# Altium schematic sheet MAIN POWER.SchDoc
size A4; DocumentNumber: 2; SheetNumber: 2; SheetTotal: 34
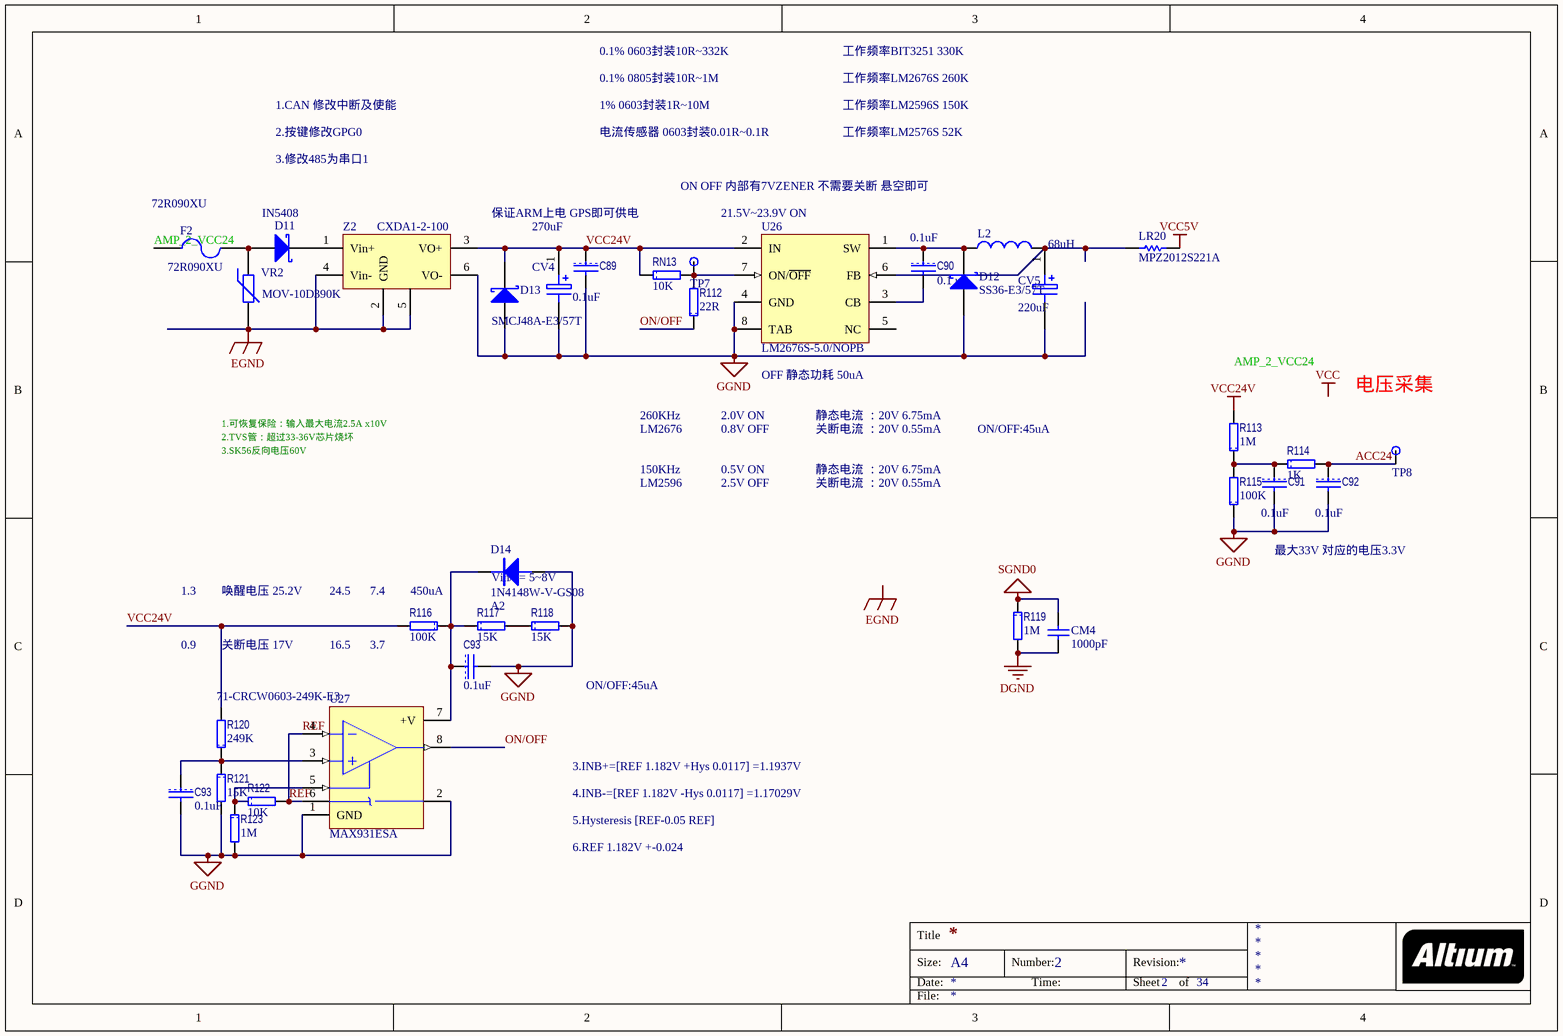
[diagram p0: MAIN POWER.SchDoc]

## Parts
(Parts that share a designator on the sheet are numbered #1, #2 ... from top to bottom, then left to right.)
C89  value 0.1uF  [1608[0603]C]  (hidden comment: C1608X7R1H104K)
C90  value 0.1uF  电容: 0.1 uF  [1608[0603]C]  (hidden comment: C1608X7R1H104K)
C91  value 0.1uF  [1608[0603]C]  (hidden comment: C1608X7R1H104K)
C92  value 0.1uF  [1608[0603]C]  (hidden comment: C1608X7R1H104K)
C93#1  value 0.1uF  [1608[0603]C]  (hidden comment: C1608X7R1H104K)
C93#2  value 0.1uF  [1608[0603]C]  (hidden comment: C1608X7R1H104K)
CM4  value 1000pF  [4532[1812]CA]  (hidden comment: 1812HC102MAZ1A)
CV4  value 270uF  [CAPPR5-10x20/H1.1]  (hidden comment: EEU-FM1H271)
CV5  value 220uF  [CAPPR5-10x20/H1.1]  (hidden comment: EEU-FM1V221)
D11  IN5408  [DO-214AB/SMC]
D12  SS36-E3/57T  [DO-214AB/SMC]
D13  SMCJ48A-E3/57T  [DO-214AB/SMC]
D14  1N4148W-V-GS08  value A2  [SOD123]
F2  72R090XU  [FUS-0.2]
L2  value 68uH  [INDP125125X85N]  (hidden comment: B82477P4683M000)
LR20  MPZ2012S221A  [2012[0805]]
R112  value 22R  [1608[0603]R]  (hidden comment: CRCW060322R0FKEA)
R113  value 1M  [1608[0603]R]  (hidden comment: CRCW06031M00FKEA)
R114  value 1K  [1608[0603]R]  (hidden comment: CRCW06031K00FKEA)
R115  value 100K  [1608[0603]R]  (hidden comment: CRCW0603100KFKEA)
R116  value 100K  [1608[0603]R]  (hidden comment: CRCW0603100KFKEA)
R117  value 15K  [1608[0603]R]  (hidden comment: CRCW060315K0FKEA)
R118  value 15K  [1608[0603]R]  (hidden comment: CRCW060315K0FKEA)
R119  value 1M  [1608[0603]R]  (hidden comment: CRCW06031M00FKEA)
R120  value 249K  Supplier Part Number 1: 71-CRCW0603-249K-E3  [1608[0603]R]  (hidden comment: CRCW0603249KFKEA)
R121  value 15K  [1608[0603]R]  (hidden comment: CRCW060315K0FKEA)
R122  value 10K  [1608[0603]R]  (hidden comment: CRCW060310K0FKEA)
R123  value 1M  [1608[0603]R]  (hidden comment: CRCW060310K0FKEA)
RN13  value 10K  [1608[0603]RN]  (hidden comment: CRCW060310K0FKEA)
TP7  TP  [TP]  (value not drawn)
TP8  TP  [TP]  (value not drawn)
U26  LM2676S-5.0/NOPB  [TS7B_N]
U27  MAX931ESA  [NSO8_N]
VR2  MOV-10D390K  [RAD-0.3]
Z2  CXDA1-2-100  [CXDA1-2-100]

## Nets
DGND: CM4.1 R119.2
EGND: VR2.2 Z2.2(GND) Z2.4(Vin-) Z2.5(GND)
GGND: C89.2 C91.2 C92.2 C93#1.2 C93#2.2 CV4.2 CV5.2 D12.1(A) D13.1(A) D14.1(A) R115.1 R118.2 R121.2 R123.2 U26.4(GND) U26.8(TAB) U27.1(GND) U27.2(-V) Z2.6(VO-)
SGND0: CM4.2 R119.1
VCC5V: LR20.2
VCC24V: C89.1 CV4.1 D13.2(K) R113.2 R116.2 R120.2 RN13.1 U26.2(IN) Z2.3(VO+)
ACC24: C92.1 R114.2 TP8.1(TestPoint)
AMP_2_VCC24: F2.1
ON/OFF: R112.1 U27.8(OUT)
REF: R122.2 U27.4(IN-) U27.6(REF)
NetC90_1: C90.1 D12.2(K) L2.1 U26.1(SW)
NetC90_2: C90.2 U26.3(CB)
NetC91_1: C91.1 R113.1 R114.1 R115.2
NetC93#1_1: C93#1.1 D14.2(K) R116.1 R117.1 U27.7(+V)
NetC93#2_1: C93#2.1 R120.1 R121.1 U27.3(IN+)
NetCV5_1: CV5.1 L2.2 LR20.1 U26.6(FB)
NetD11_1: D11.1(A) F2.2 VR2.1
NetD11_2: D11.2(K) Z2.1(Vin+)
NetR112_2: R112.2 RN13.2 TP7.1(TestPoint) U26.7(ON/~{OFF})
NetR117_2: R117.2 R118.1
NetR122_1: R122.1 R123.1 U27.5(HYST)

Not connected (* = marked no-connect by the designer): U26 5(NC)

## Notes on the sheet
- 1.CAN 修改中断及使能
- 0.1% 0603封装10R~332K
- 0.1% 0805封装10R~1M
- 1% 0603封装1R~10M
- 工作频率LM2676S 260K
- 工作频率LM2596S 150K
- 工作频率BIT3251 330K
- 2.按键修改GPG0
- 3.修改485为串口1
- 电流传感器 0603封装0.01R~0.1R
- 工作频率LM2576S 52K
- 保证ARM上电 GPS即可供电
- ON OFF 内部有7VZENER 不需要关断 悬空即可
- (near U26) 21.5V~23.9V ON
- (near U26) OFF 静态功耗 50uA
- 1.可恢复保险：输入最大电流2.5A x10V
- 2.TVS管：超过33-36V芯片烧坏
- 260KHz
- LM2676
- 0.8V OFF
- 2.0V ON
- 静态电流 ：20V 6.75mA
- 关断电流 ：20V 0.55mA
- ON/OFF:45uA
- 电压采集
- 3.SK56反向电压60V
- LM2596
- 150KHz
- 2.5V OFF
- 0.5V ON
- (near D14) Vin/4= 5~8V
- 最大33V 对应的电压3.3V
- 0.9
- 1.3
- 唤醒电压 25.2V
- 关断电压 17V
- 24.5
- 16.5
- (near R116) 7.4
- (near R116) 3.7
- (near R116) 450uA
- 3.INB+=[REF 1.182V +Hys 0.0117] =1.1937V
- 6.REF 1.182V +-0.024
- 5.Hysteresis [REF-0.05 REF]
- 4.INB-=[REF 1.182V -Hys 0.0117] =1.17029V
- Labels drawn without touching a wire or pin: AMP_2_VCC24, EGND, VCC
- Title
- Size:
- Date:
- A4
- Number:
- Time:
- Revision:
- Sheet
- of
- File:

## Library data of the parts
C89 C90 C93#1 C93#2 = CAP: 多层陶瓷电容器MLCC - SMD/SMT 0603 0.1uF 50volts X7R 10%; Manufacturer: TDK; 尺寸: 0.8 mm W x 1.6 mm L x 0.8 mm H; 工作温度范围: - 55 C to + 125 C; 封装 / 箱体: 0603 (1608 metric); 封装: Reel; 产品: General Type MLCCs; 系列: C; 电压额定值: 50 V; 电容-nF: 100 nF; 电容-pF: 100000 pF; 外壳代码 - in: 0603; 外壳代码 - mm: 1608; 产品种类: Low & Medium Capacitance SMD Ceramic Chip Capacitors; 标准包装数量: 4000; Supplier 1: Mouser; Supplier Part Number 1: 810-C1608X7R1H104K; Manufacturer Part Number: C1608X7R1H104K; RoHS: RoHS Compliant; Description 1: 多层陶瓷电容器MLCC - SMD/SMT 0603 0.1uF 50volts X7R 10%; Category: 多层陶瓷电容器MLCC - SMD/SMT; Stock 1: 224604; Pricing 1: 1=0.160, 50=0.070, 100=0.036, 500=0.019, 1000=0.013, 4000=0.010, 8000=0.009, 12000=0.008, 20000=0.007 (USD); 端接类型: SMD/SMT; 容差: 10 %; 制造商: TDK; 温度系数/代码: X7R; RoHS - 贸泽: Y; Minimum Order Quantity: 1; Reeling: True; ComponentLink1URL: http://www.tdk.com/pdf/general_B11.pdf; ComponentLink1Description: http://www.tdk.com/pdf/general_B11.pdf
  C89 C93#1 C93#2: 电容: 0.1 uF
C91 C92 = CAP: 多层陶瓷电容器MLCC - SMD/SMT 0603 0.1uF 50volts X7R 10%; Manufacturer: TDK; 产品: General Type MLCCs; 产品种类: Low & Medium Capacitance SMD Ceramic Chip Capacitors; 外壳代码 - in: 0603; 外壳代码 - mm: 1608; 封装 / 箱体: 0603 (1608 metric); 封装: Reel; 尺寸: 0.8 mm W x 1.6 mm L x 0.8 mm H; 工作温度范围: - 55 C to + 125 C; 标准包装数量: 4000; 电压额定值: 50 V; 电容-nF: 100 nF; 电容-pF: 100000 pF; 系列: C; Category: 多层陶瓷电容器MLCC - SMD/SMT; ComponentLink1Description: http://www.tdk.com/pdf/general_B11.pdf; ComponentLink1URL: http://www.tdk.com/pdf/general_B11.pdf; Description 1: 多层陶瓷电容器MLCC - SMD/SMT 0603 0.1uF 50volts X7R 10%; Manufacturer Part Number: C1608X7R1H104K; Minimum Order Quantity: 1; Pricing 1: 1=0.160, 50=0.070, 100=0.036, 500=0.019, 1000=0.013, 4000=0.010, 8000=0.009, 12000=0.008, 20000=0.007 (USD); Reeling: True; RoHS - 贸泽: Y; RoHS: RoHS Compliant; Stock 1: 224604; Supplier 1: Mouser; Supplier Part Number 1: 810-C1608X7R1H104K; 制造商: TDK; 容差: 10 %; 温度系数/代码: X7R; 电容: 0.1 uF; 端接类型: SMD/SMT
CM4 = Cap: 多层陶瓷电容器MLCC - SMD/SMT 1000pF 3000volts 20%; Manufacturer: AVX; 尺寸: 3.2 mm W x 4.5 mm L x 2.54 mm H; 工作温度范围: - 55 C to + 125 C; 封装 / 箱体: 1812 (4532 metric); 封装: Reel; 产品: Flexible Termination MLCCs; 电压额定值: 3 kV; 电容-nF: 1 nF; 电容-uF: 0.001 uF; 外壳代码 - in: 1812; 外壳代码 - mm: 4532; 产品种类: Flexiterm SMD Ceramic Capacitors; 标准包装数量: 1000; 温度系数/代码: X7R; 商标名: Flexiterm; Supplier 1: Mouser; Supplier Part Number 1: 581-1812HC102MAZ1A; Manufacturer Part Number: 1812HC102MAZ1A; RoHS: RoHS Compliant By Exemption; Description 1: 多层陶瓷电容器MLCC - SMD/SMT 1000pF 3000volts 20%; Category: 多层陶瓷电容器MLCC - SMD/SMT; Stock 1: 1062; Pricing 1: 1=1.52, 50=1.26, 100=1.14, 500=0.790, 1000=0.620, 4000=0.460, 8000=0.440, 12000=0.420, 20000=0.387 (USD); 电容: 1000 pF; 端接类型: SMD/SMT; 容差: 20 %; 制造商: AVX; RoHS - 贸泽: E; Minimum Order Quantity: 1; Reeling: True; ComponentLink1URL: http://www.avx.com/docs/catalogs/flexitermhv.pdf; ComponentLink1Description: http://www.avx.com/docs/catalogs/flexitermhv.pdf
CV4 = ELECTRO1: 插针 铝质电解电容器 - 带引线 270UF 50V ELECT FM RADIAL; Manufacturer: Panasonic Electronic Components; 工作温度范围: - 40 C to + 105 C; 封装: Bulk; 产品: Low Impedance Electrolytic Capacitors; 容差: 20 %; 外壳直径: 10 mm; 外壳长度: 20 mm; 损耗因数 DF: 0.1; 引线间隔: 5 mm; 加载寿命: 5000 hr; 制造商: Panasonic; 纹波电流: 1890 mA; 标准包装数量: 200; Supplier 1: Mouser; Supplier Part Number 1: 667-EEU-FM1H271; Manufacturer Part Number: EEU-FM1H271; RoHS: RoHS Compliant; Description 1: 铝质电解电容器 - 带引线 270UF 50V ELECT FM RADIAL; Category: 铝质电解电容器 - 带引线; Stock 1: 264; Pricing 1: 1=0.370, 25=0.334, 100=0.305, 250=0.281, 500=0.246, 1000=0.226, 2000=0.216, 5000=0.200 (USD); 电容: 270 uF; 系列: FM; 端接类型: Radial; 电压额定值: 50 V; RoHS - 贸泽: Y; Minimum Order Quantity: 1; Reeling: False; ComponentLink1URL: http://www.mouser.com/ds/2/315/ABA0000CE108-5973.pdf; ComponentLink1Description: http://www.mouser.com/ds/2/315/ABA0000CE108-5973.pdf
CV5 = ELECTRO1: 插针 铝质电解电容器 - 带引线 220UF 35V ELECT FM RADIAL; Manufacturer: Panasonic Electronic Components; Manufacturer Part Number: EEU-FM1V471; Description 1: 铝质电解电容器 - 带引线 470UF 35V ELECT FM RADIAL; 电容: 470 uF; 工作温度范围: - 40 C to + 105 C; 封装: Bulk; 产品: General Purpose Electrolytic Capacitors; 容差: 20 %; 外壳直径: 10 mm; 外壳长度: 20 mm; 引线间隔: 5 mm; 制造商: Panasonic; 标准包装数量: 200; Supplier 1: Mouser; Supplier Part Number 1: 667-EEU-FM1V471; RoHS: RoHS Compliant; Category: 铝质电解电容器 - 带引线; Stock 1: 8429; Pricing 1: 1=0.300, 25=0.281, 100=0.258, 250=0.238, 500=0.230, 1000=0.226, 2000=0.216, 5000=0.200 (USD); 系列: FM; 端接类型: Radial; 电压额定值: 35 V; RoHS - 贸泽: Y; Minimum Order Quantity: 1; Reeling: False; ComponentLink1URL: http://www.mouser.com/ds/2/315/ABA0000CE108-5973.pdf; ComponentLink1Description: http://www.mouser.com/ds/2/315/ABA0000CE108-5973.pdf
D11 = D Schottky: 肖特基二极管与整流器 3.0 Amp 60 Volt; Manufacturer: Vishay Semiconductors; Manufacturer Part Number: SS36-E3/57T; 配置: Single; 工作温度范围: - 55 C to + 150 C; 封装 / 箱体: SMC (DO-214AB); 封装: Reel; 产品: Schottky Rectifiers; 正向连续电流: 3 A; 最大浪涌电流: 100 A; 安装风格: SMD/SMT; 正向电压下降: 0.75 V; 制造商: Vishay; 最大反向漏泄电流: 500 uA; 峰值反向电压: 60 V; 标准包装数量: 850; Supplier 1: Mouser; Supplier Part Number 1: 625-SS36-E3; RoHS: RoHS Compliant By Exemption; Description 1: 肖特基二极管与整流器 3.0 Amp 60 Volt; Category: 肖特基二极管与整流器; Stock 1: 481; Pricing 1: 1=0.280, 10=0.250, 100=0.188, 250=0.154, 500=0.144, 850=0.144, 1000=0.139, 2000=0.131 (USD); 产品种类: Schottky Rectifiers; RoHS - 贸泽: E; Minimum Order Quantity: 1; Reeling: True; ComponentLink1URL: http://www.mouser.com/ds/2/427/88751-106389.pdf; ComponentLink1Description: http://www.mouser.com/ds/2/427/88751-106389.pdf
D12 = D Schottky: 肖特基二极管与整流器 3.0 Amp 60 Volt; Manufacturer: Vishay Semiconductors; 配置: Single; 工作温度范围: - 55 C to + 150 C; 封装 / 箱体: SMC (DO-214AB); 封装: Reel; 产品: Schottky Rectifiers; 正向连续电流: 3 A; 最大浪涌电流: 100 A; 安装风格: SMD/SMT; 正向电压下降: 0.75 V; 制造商: Vishay; 最大反向漏泄电流: 500 uA; 峰值反向电压: 60 V; 标准包装数量: 850; Supplier 1: Mouser; Supplier Part Number 1: 625-SS36-E3; Manufacturer Part Number: SS36-E3/57T; RoHS: RoHS Compliant By Exemption; Description 1: 肖特基二极管与整流器 3.0 Amp 60 Volt; Category: 肖特基二极管与整流器; Stock 1: 481; Pricing 1: 1=0.280, 10=0.250, 100=0.188, 250=0.154, 500=0.144, 850=0.144, 1000=0.139, 2000=0.131 (USD); 产品种类: Schottky Rectifiers; RoHS - 贸泽: E; Minimum Order Quantity: 1; Reeling: True; ComponentLink1URL: http://www.mouser.com/ds/2/427/88751-106389.pdf; ComponentLink1Description: http://www.mouser.com/ds/2/427/88751-106389.pdf
D13 = 30BQ040: TVS 二极管 - 瞬态电压抑制器 1500W 48V Unidirect; Manufacturer: Vishay Semiconductors; 击穿电压: 53.3 V to 58.9 V; 钳位电压: 77.4 V; 尺寸: 6.22 mm W x 7.11 mm L x 2.62 mm H; 封装 / 箱体: DO-214AB; 封装: Reel; 系列: SMCJ; 端接类型: SMD/SMT; 通道: 1 Channel; 峰值浪涌电流: 19.4 A; 制造商: Vishay; 最大工作温度: + 150 C; 最小工作温度: - 55 C; 极性: Unidirectional; 产品种类: Transient Voltage Suppressors; 标准包装数量: 850; 商标名: TransZorb; Supplier 1: Mouser; Supplier Part Number 1: 625-SMCJ48A-E3; Manufacturer Part Number: SMCJ48A-E3/57T; RoHS: RoHS Compliant By Exemption; Description 1: TVS 二极管 - 瞬态电压抑制器 1500W 48V Unidirect; Category: TVS 二极管 - 瞬态电压抑制器; Stock 1: 1923; Pricing 1: 1=0.670, 10=0.580, 100=0.457, 850=0.457, 1000=0.244, 5000=0.206, 10000=0.198, 25000=0.125, 50000=0.122, 100000=0.120 (USD); 工作电压: 48 V; 安装风格: SMD/SMT; 峰值脉冲功率耗散: 1500 W; RoHS - 贸泽: E; Minimum Order Quantity: 1; Reeling: True; ComponentLink1URL: http://www.mouser.com/ds/2/427/smcj50a-241829.pdf; ComponentLink1Description: http://www.mouser.com/ds/2/427/smcj50a-241829.pdf
D14 = 1N4148W: 二极管 - 通用，功率，开关 100V Io/150mA; Manufacturer: Vishay Semiconductors; 配置: Single; 工作温度范围: - 65 C to + 150 C; 封装 / 箱体: SOD-123; 封装: Reel; 产品: Switching Diodes; 正向连续电流: 0.15 A; 最大浪涌电流: 0.5 A; 安装风格: SMD/SMT; 恢复时间: 4 ns; 正向电压下降: 1.2 V; 制造商: Vishay; 最大二极管电容: 4 pF; 最大工作温度: + 150 C; 最大功率耗散: 350 mW; 最大反向漏泄电流: 5 uA; 最小工作温度: - 65 C; 标准包装数量: 15000; Supplier 1: Mouser; Supplier Part Number 1: 625-1N4148W-V; Manufacturer Part Number: 1N4148W-V-GS08; RoHS: RoHS Compliant; Category: 二极管 - 通用，功率，开关; Stock 1: 404148; Pricing 1: 1=0.090, 10=0.083, 50=0.072, 100=0.068, 500=0.032, 1000=0.026, 3000=0.021, 9000=0.016, 10000=0.016, 18000=0.014 (USD); 峰值反向电压: 100 V; 产品种类: Switching Diodes; RoHS - 贸泽: Y; Minimum Order Quantity: 1; Reeling: True; ComponentLink1URL: http://www.mouser.com/ds/2/427/1n4148w--240387.pdf; ComponentLink1Description: http://www.mouser.com/ds/2/427/1n4148w--240387.pdf; Description 1: 二极管 - 通用，功率，开关 100V Io/150mA
F2 = Fuse 2: Resettable Fuses - PPTC PTC POLYFUSE RADIAL 72V .900A; Manufacturer: Littelfuse; Resistance: 470 mOhms; Type: PolyFuse Resettable PTC; Current Rating - Max: 40 A; Hold Current: 0.9 A; Maximum Voltage: 72 VDC; Trip Current: 1.8 A; Supplier 1: Mouser; Supplier Part Number 1: 576-72R090XU; Manufacturer Part Number: 72R090XU; RoHS: RoHS Compliant; Category: Resettable Fuses - PPTC; Stock 1: 433; Pricing 1: 1=0.621, 10=0.514, 100=0.427, 250=0.389, 500=0.329, 1000=0.290, 2500=0.266, 5000=0.262, 10000=0.243 (AUD); Dimensions: 15.8 mm L x 3.1 mm  H x 11.2 mm D; Operating Temperature Range: - 40 C to + 85 C; Packaging: Bulk; Series: 72R; Termination Style: Radial; Mounting Style: Through Hole; Lead Spacing: 5.1 mm; Product Category: Resettable PTCs; Standard Pack Qty: 500; RoHS - Mouser: Y; Minimum Order Quantity: 1; Reeling: False; ComponentLink1URL: http://www.littelfuse.com/data/en/Data_Sheets/Littelfuse_PTCs_72R.pdf; ComponentLink1Description: http://www.littelfuse.com/data/en/Data_Sheets/Littelfuse_PTCs_72R.pdf
L2 = Inductor: 固定电感器 SMT-INDUCTOR 12X12 68UH 2.35A; Manufacturer: EPCOS; 最大直流电流: 2.45 A; 最大直流电阻: 0.098 Ohms; 产品: SMD Power Inductors; 端接类型: SMD/SMT; 容差: 20 %; Supplier 1: Mouser; Supplier Part Number 1: 871-B82477P4683M000; Manufacturer Part Number: B82477P4683M000; RoHS: RoHS Compliant; Description 1: 固定电感器 SMT-INDUCTOR 12X12 68UH 2.35A; Category: 固定电感器; Stock 1: 1400; Pricing 1: 1=2.55, 50=1.96, 100=1.78, 500=1.62, 1000=1.49, 2000=1.37, 5000=1.26, 10000=1.16 (USD); 电感: 68 uH; 制造商: EPCOS; RoHS - 贸泽: Y; Minimum Order Quantity: 1; Reeling: False; ComponentLink1URL: http://www.mouser.com/ds/2/136/b82477p4-80660.pdf; ComponentLink1Description: http://www.mouser.com/ds/2/136/b82477p4-80660.pdf
LR20 = Res Semi: 电磁干扰滤波珠子、扼流圈和阵列 Ferrite Chip Beads; Manufacturer: TDK; 阻抗: 220 Ohms; 最大直流电流: 3 A; 最大直流电阻: 0.04 Ohms; 工作温度范围: - 55 C to + 125 C; 封装 / 箱体: 2012; 封装: Reel; 端接类型: SMD/SMT; 容差: 25 %; 产品种类: Ferrite Beads; 标准包装数量: 4000; Supplier 1: Mouser; Supplier Part Number 1: 810-MPZ2012S221A; Manufacturer Part Number: MPZ2012S221A; RoHS: RoHS Compliant; Description 1: 电磁干扰滤波珠子、扼流圈和阵列 Ferrite Chip Beads; Category: 电磁干扰滤波珠子、扼流圈和阵列; Stock 1: 26540; Pricing 1: 1=0.070, 50=0.060, 100=0.053, 500=0.040, 1000=0.035, 4000=0.031, 8000=0.029, 12000=0.025 (USD); 制造商: TDK; RoHS - 贸泽: Y; Minimum Order Quantity: 1; Reeling: True; ComponentLink1URL: http://www.mouser.com/ds/2/400/e9413_mpz-24582.pdf; ComponentLink1Description: http://www.mouser.com/ds/2/400/e9413_mpz-24582.pdf
R112 = RES: 厚膜电阻器 - SMD 1/10watt 22ohms 1%; Manufacturer: Vishay / Dale; 尺寸: 0.85 mm W x 1.55 mm L x 0.45 mm H; 工作温度范围: - 55 C to + 155 C; 封装 / 箱体: 0603 (1608 metric); 封装: Reel; 功率额定值: 100 mW; 产品: Thick Film Resistors SMD; 系列: CRCW; 温度系数: 100 PPM / K; 端接类型: SMD/SMT; 电压额定值: 75 V; 制造商: Vishay; 标准包装数量: 5000; 外壳代码 - in: 0603; 外壳代码 - mm: 1608; 产品种类: 0603 Thick Film Chip Resistors; Supplier 1: Mouser; Supplier Part Number 1: 71-CRCW0603-22-E3; Manufacturer Part Number: CRCW060322R0FKEA; RoHS: RoHS Compliant By Exemption; Category: 厚膜电阻器 - SMD; Stock 1: 35802; 电阻: 22 Ohms; 容差: 1 %; Minimum Order Quantity: 1; Reeling: True; ComponentLink1URL: http://www.mouser.com/ds/2/427/dcrcwe3-109170.pdf; ComponentLink1Description: http://www.mouser.com/ds/2/427/dcrcwe3-109170.pdf; Description 1: 厚膜电阻器 - SMD 1/10watt 22ohms 1%; Pricing 1: 1=0.080, 10=0.013, 100=0.010, 1000=0.008, 5000=0.005, 25000=0.004, 50000=0.003 (USD); RoHS - 贸泽: E
R113 R119 = RES: 厚膜电阻器 - SMD 1/10watt 1.0Mohms 1%; Manufacturer: Vishay / Dale; 尺寸: 0.85 mm W x 1.55 mm L x 0.45 mm H; 工作温度范围: - 55 C to + 155 C; 封装 / 箱体: 0603 (1608 metric); 封装: Reel; 功率额定值: 100 mW; 产品: Thick Film Resistors SMD; 电阻: 1 MOhms; 系列: CRCW; 温度系数: 100 PPM / K; 端接类型: SMD/SMT; 电压额定值: 75 V; 外壳代码 - in: 0603; 外壳代码 - mm: 1608; 制造商: Vishay; 产品种类: 0603 Thick Film Chip Resistors; 标准包装数量: 5000; Supplier 1: Mouser; Supplier Part Number 1: 71-CRCW0603-1.0M-E3; Manufacturer Part Number: CRCW06031M00FKEA; RoHS: RoHS Compliant By Exemption; Category: 厚膜电阻器 - SMD; Stock 1: 71394; Pricing 1: 1=0.080, 10=0.013, 100=0.010, 1000=0.008, 5000=0.005, 25000=0.004, 50000=0.003 (USD); 容差: 1 %; RoHS - 贸泽: E; Minimum Order Quantity: 1; Reeling: True; ComponentLink1URL: http://www.mouser.com/ds/2/427/dcrcwe3-109170.pdf; ComponentLink1Description: http://www.mouser.com/ds/2/427/dcrcwe3-109170.pdf; Description 1: 厚膜电阻器 - SMD 1/10watt 1.0Mohms 1%
R114 = RES: 厚膜电阻器 - SMD 1/10watt 1.0Kohms 1%; Manufacturer: Vishay / Dale; 尺寸: 0.85 mm W x 1.55 mm L x 0.45 mm H; 工作温度范围: - 55 C to + 155 C; 封装 / 箱体: 0603 (1608 metric); 封装: Reel; 功率额定值: 100 mW; 产品: Thick Film Resistors SMD; 电阻: 1 kOhms; 系列: CRCW; 温度系数: 100 PPM / K; 端接类型: SMD/SMT; 电压额定值: 75 V; 制造商: Vishay; 产品种类: 0603 Thick Film Chip Resistors; 标准包装数量: 5000; 外壳代码 - in: 0603; 外壳代码 - mm: 1608; Supplier 1: Mouser; Supplier Part Number 1: 71-CRCW0603-1.0K-E3; Manufacturer Part Number: CRCW06031K00FKEA; RoHS: RoHS Compliant By Exemption; Category: 厚膜电阻器 - SMD; Stock 1: 276938; Pricing 1: 1=0.080, 10=0.013, 100=0.010, 1000=0.008, 5000=0.005, 25000=0.004, 50000=0.003 (USD); 容差: 1 %; RoHS - 贸泽: E; Minimum Order Quantity: 1; Reeling: True; ComponentLink1URL: http://www.mouser.com/ds/2/427/dcrcwe3-109170.pdf; ComponentLink1Description: http://www.mouser.com/ds/2/427/dcrcwe3-109170.pdf; Description 1: 厚膜电阻器 - SMD 1/10watt 1.0Kohms 1%
R115 = RES: 厚膜电阻器 - SMD 1/10watt 100Kohms 1%; Manufacturer: Vishay / Dale; 尺寸: 0.85 mm W x 1.55 mm L x 0.45 mm H; 工作温度范围: - 55 C to + 155 C; 封装 / 箱体: 0603 (1608 metric); 封装: Reel; 功率额定值: 100 mW; 产品: Thick Film Resistors SMD; 系列: CRCW; 温度系数: 100 PPM / K; 端接类型: SMD/SMT; 电压额定值: 75 V; 制造商: Vishay; 产品种类: 0603 Thick Film Chip Resistors; 标准包装数量: 5000; 外壳代码 - in: 0603; 外壳代码 - mm: 1608; Supplier 1: Mouser; Supplier Part Number 1: 71-CRCW0603-100K-E3; Manufacturer Part Number: CRCW0603100KFKEA; RoHS: RoHS Compliant By Exemption; Category: 厚膜电阻器 - SMD; Stock 1: 175756; Pricing 1: 1=0.080, 10=0.013, 100=0.010, 1000=0.008, 5000=0.005, 25000=0.004, 50000=0.003 (USD); 电阻: 100 kOhms; 容差: 1 %; RoHS - 贸泽: E; Minimum Order Quantity: 1; Reeling: True; ComponentLink1URL: http://www.mouser.com/ds/2/427/dcrcwe3-109170.pdf; ComponentLink1Description: http://www.mouser.com/ds/2/427/dcrcwe3-109170.pdf; Description 1: 厚膜电阻器 - SMD 1/10watt 100Kohms 1%
R116 = RES: 厚膜电阻器 - SMD 1/10watt 100Kohms 1%
R117 R118 R121 = RES: 厚膜电阻器 - SMD 1/10watt 15Kohms 1%; Manufacturer: Vishay / Dale; Power Rating: 100 mW; Temperature Coefficient: 100 PPM / K; Voltage Rating: 75 V; Case Height: 0.45 mm; Case Length: 1.55 mm; Case Width: 0.85 mm; Supplier 1: Mouser; Supplier Part Number 1: 71-CRCW0603-15K-E3; Manufacturer Part Number: CRCW060315K0FKEA; RoHS: RoHS Compliant By Exemption; Category: Thick Film Resistors - SMD; Stock 1: 103280; Pricing 1: 1=0.108, 10=0.018, 100=0.014, 1000=0.011, 5000=0.007, 25000=0.005, 50000=0.004 (AUD); Operating Temperature Range: - 55 C to + 155 C; Package / Case: 0603 (1608 metric); Packaging: Reel; Product: Thick Film Resistors SMD; Resistance: 15 kOhms; Series: CRCW; Tolerance: 1 %; Case Code - in: 0603; Case Code - mm: 1608; Product Category: 0603 Thick Film Chip Resistors; Standard Pack Qty: 5000; RoHS - Mouser: E; Minimum Order Quantity: 1; Reeling: True; ComponentLink1URL: http://www.vishay.com/doc?20035; ComponentLink1Description: http://www.vishay.com/doc?20035
R120 = RES: 厚膜电阻器 - SMD 1/10watt 249Kohms 1%; Manufacturer: Vishay / Dale; Power Rating: 100 mW; Temperature Coefficient: 100 PPM / K; Voltage Rating: 75 V; Case Height: 0.45 mm; Case Length: 1.55 mm; Case Width: 0.85 mm; Supplier 1: Mouser; Manufacturer Part Number: CRCW0603249KFKEA; RoHS: RoHS Compliant By Exemption; Category: Thick Film Resistors - SMD; Stock 1: 63391; Pricing 1: 1=0.108, 10=0.018, 100=0.014, 1000=0.011, 5000=0.007, 25000=0.005, 50000=0.004 (AUD); Operating Temperature Range: - 55 C to + 155 C; Package / Case: 0603 (1608 metric); Packaging: Reel; Product: Thick Film Resistors SMD; Resistance: 249 kOhms; Series: CRCW; Tolerance: 1 %; Case Code - in: 0603; Case Code - mm: 1608; Product Category: 0603 Thick Film Chip Resistors; Standard Pack Qty: 5000; RoHS - Mouser: E; Minimum Order Quantity: 1; Reeling: True; ComponentLink1URL: http://www.vishay.com/doc?20035; ComponentLink1Description: http://www.vishay.com/doc?20035
R122 R123 RN13 = RES: 厚膜电阻器 - SMD 1/10watt 10Kohms 1%; Manufacturer: Vishay / Dale; 尺寸: 0.85 mm W x 1.55 mm L x 0.45 mm H; 工作温度范围: - 55 C to + 155 C; 封装 / 箱体: 0603 (1608 metric); 封装: Reel; 功率额定值: 100 mW; 产品: Thick Film Resistors SMD; 系列: CRCW; 温度系数: 100 PPM / K; 端接类型: SMD/SMT; 电压额定值: 75 V; 制造商: Vishay; 产品种类: 0603 Thick Film Chip Resistors; 标准包装数量: 5000; 外壳代码 - in: 0603; 外壳代码 - mm: 1608; Supplier 1: Mouser; Supplier Part Number 1: 71-CRCW0603-10K-E3; Manufacturer Part Number: CRCW060310K0FKEA; RoHS: RoHS Compliant By Exemption; Category: 厚膜电阻器 - SMD; Stock 1: 0; Pricing 1: 1=0.080, 10=0.013, 100=0.010, 1000=0.008, 5000=0.005, 25000=0.004, 50000=0.003 (USD); 电阻: 10 kOhms; 容差: 1 %; RoHS - 贸泽: E; Minimum Order Quantity: 1; Reeling: True; ComponentLink1URL: http://www.mouser.com/ds/2/427/dcrcwe3-109170.pdf; ComponentLink1Description: http://www.mouser.com/ds/2/427/dcrcwe3-109170.pdf; Description 1: 厚膜电阻器 - SMD 1/10watt 10Kohms 1%
TP7 TP8 = Test Point
U26 = LM2676S-5.0/NOPB: SIMPLE SWITCHER?High Efficiency 3A Step-Down Voltage Regulator, 7-pin TO-263, Pb-Free; Manufacturer: Texas Instruments; Description 1: 直流/直流开关转换器 HIGH EFF 3A STEP- DOWN VLTG REG; 最大输入电压: 40 V; 输出端数量: 1; 工作温度范围: - 40 C to + 85 C; 输出电压: 5 V; 封装 / 箱体: TO-263-7; 封装: Tube; 系列: LM2676; 类型: Step Down; 安装风格: SMD/SMT; 开关频率: 260 KHz; 最小输入电压: 8 V; 最大工作温度: + 125 C; 最小工作温度: - 40 C; 标准包装数量: 45; Product Status: New at Mouser; Supplier 1: Mouser; Supplier Part Number 1: 926-LM2676S-5.0/NOPB; Manufacturer Part Number: LM2676S-5.0/NOPB; RoHS: RoHS Compliant; Category: 直流/直流开关转换器; Stock 1: 11538; Pricing 1: 1=4.05, 10=3.64, 25=3.24, 50=3.05, 100=2.18, 250=2.14, 500=2.10, 750=2.06, 1000=2.02 (USD); 输出电流: 3 A; 制造商: Texas Instruments; RoHS - 贸泽: Y; Minimum Order Quantity: 1; Reeling: False; ComponentLink1URL: http://www.ti.com/litv/SNVS031H; ComponentLink1Description: http://www.ti.com/litv/SNVS031H
U27 = MAX931ESA: Ultra Low-Power, Low-Cost Comparator with 2% Reference; Published: 16-Jan-2001; LatestRevisionDate: 13-Apr-2006; LatestRevisionNote: IPC-7351 Footprint Added.; DatasheetVersion: Feb-1997; PackageReference: NSO8; Publisher: Altium Limited; PackageDescription: 8-Pin Small Outline Integrated Circuit 1.27 mm Pitch; Code_JEDEC: MS-012-AA; Code_IPC: SOIC127P600-8; ComponentLink1Description: Manufacturer Link; ComponentLink1URL: http://www.maxim-ic.com/; ComponentLink2Description: Datasheet; ComponentLink2URL: http://pdfserv.maxim-ic.com/en/ds/MAX931-MAX934.pdf
VR2 = Res Varistor: 插针 压敏电阻 500A 39volts 10%; Manufacturer: Bourns; Description 1: 压敏电阻 2400pF 39volts 10%; 电容: 2400 pF; 钳位电压: 77 V; 直径: 10 mm; 尺寸: 12.5 mm Dia. x 7.2 mm W; 安装: Radial; 工作温度范围: - 40 C to + 85 C; 封装: Bulk; 浪涌能量额定值: 4.6 J; 电压额定值 DC: 43 V; 外壳直径: 12.5 mm; 外壳宽度: 7.2 mm; Supplier 1: Mouser; Supplier Part Number 1: 652-MOV-10D390K; Manufacturer Part Number: MOV-10D390K; RoHS: RoHS Compliant; Category: 压敏电阻; Stock 1: 13078; Pricing 1: 1=0.200, 10=0.165, 100=0.154, 250=0.137, 500=0.114, 1000=0.108, 5000=0.077, 10000=0.076 (USD); 容差: 10 %; 峰值浪涌电流: 500 A; 制造商: Bourns; RoHS - 贸泽: Y; Minimum Order Quantity: 1; Reeling: False; ComponentLink1URL: http://www.bourns.com/data/global/pdfs/MOV10D.pdf; ComponentLink1Description: http://www.bourns.com/data/global/pdfs/MOV10D.pdf; Supplier 2: Mouser; Supplier Part Number 2: 667-ERZ-V10D390
Z2 = CXDB: 插针 Filter; 公司: 中北创新